# Altium schematic sheet Arduino.SchDoc
size A4
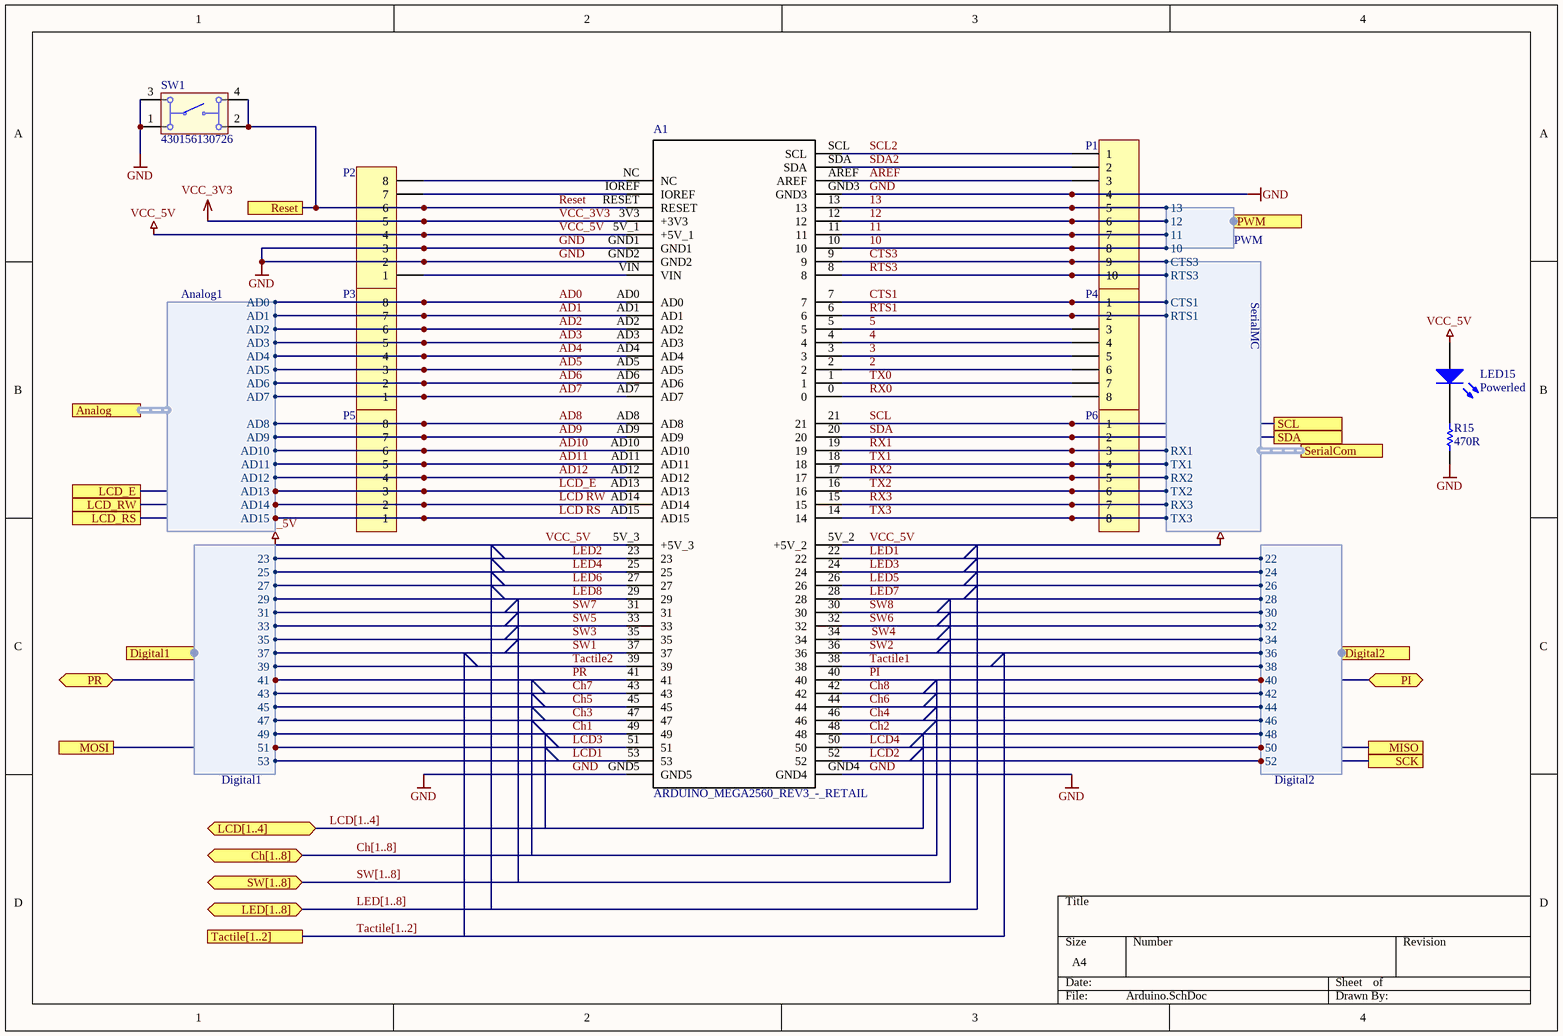
[diagram p0: Arduino.SchDoc]

## Parts
A1  ARDUINO_MEGA2560_REV3_-_RETAIL  [*ARDUINO_MEGA2560_REV3_-_RETAIL_ARDUINO_MEGA2560_REV3_-_RETAIL(Primary)]
LED15  Powerled  [1206_A]
P1  Header 10  [HDR1X10]  (value not drawn)
P2  Header 8  [HDR1X8]  (value not drawn)
P3  Header 8  [HDR1X8]  (value not drawn)
P4  Header 8  [HDR1X8]  (value not drawn)
P5  Header 8  [HDR1X8]  (value not drawn)
P6  Header 8  [HDR1X8]  (value not drawn)
R15  470R  [RESC0805(2012)_M]
SW1  430156130726  [430156130726]

## Ports
Analog (harness Analog1), Ch[1..8] (bidir), Digital1 (harness Digital1), Digital2 (harness Digital2), LCD[1..4] (bidir), LCD_E, LCD_RS, LCD_RW, LED[1..8] (bidir), MISO, MOSI, PI (bidir), PR (bidir), PWM (harness PWM), Reset, SCK, SCL, SDA, SerialCom (harness SerialMC), SW[1..8] (bidir), Tactile[1..2]

## Harnesses
SerialMC: TX3, RX3, TX2, RX2, TX1, CTS3, RTS3, CTS1, RTS1, RX1
Analog1: AD0, AD1, AD2, AD3, AD4, AD5, AD6, AD7, AD8, AD9, AD10, AD11, AD12, AD13, AD14, AD15
Digital1: 23, 25, 27, 29, 31, 33, 35, 37, 39, 41, 43, 45, 47, 49, 51, 53
Digital2: 22, 24, 26, 28, 30, 32, 34, 36, 38, 40, 42, 44, 46, 48, 50, 52
PWM: 10, 11, 12, 13

## Nets
GND: A1.GND1 A1.GND2 A1.GND3 A1.GND4 A1.GND5 P1.4 P2.2 P2.3 R15.1 SW1.1 SW1.3
VCC_3V3: A1.3V3(+3V3) P2.5
VCC_5V: A1.5V_1(+5V_1) A1.5V_2(+5V_2) A1.5V_3(+5V_3) LED15.2(A) P2.4
2: A1.2 P4.6
3: A1.3 P4.5
4: A1.4 P4.4
5: A1.5 P4.3
10: A1.10 P1.8 ; port PWM.10
11: A1.11 P1.7 ; port PWM.11
12: A1.12 P1.6 ; port PWM.12
13: A1.13 P1.5 ; port PWM.13
AD0: A1.AD0 P3.8 ; port Analog.AD0
AD1: A1.AD1 P3.7 ; port Analog.AD1
AD2: A1.AD2 P3.6 ; port Analog.AD2
AD3: A1.AD3 P3.5 ; port Analog.AD3
AD4: A1.AD4 P3.4 ; port Analog.AD4
AD5: A1.AD5 P3.3 ; port Analog.AD5
AD6: A1.AD6 P3.2 ; port Analog.AD6
AD7: A1.AD7 P3.1 ; port Analog.AD7
AD8: A1.AD8 P5.8 ; port Analog.AD8
AD9: A1.AD9 P5.7 ; port Analog.AD9
AD10: A1.AD10 P5.6 ; port Analog.AD10
AD11: A1.AD11 P5.5 ; port Analog.AD11
AD12: A1.AD12 P5.4 ; port Analog.AD12
AREF: A1.AREF P1.3
Ch1: A1.49 ; port Digital1.49
Ch2: A1.48 ; port Digital2.48
Ch3: A1.47 ; port Digital1.47
Ch4: A1.46 ; port Digital2.46
Ch5: A1.45 ; port Digital1.45
Ch6: A1.44 ; port Digital2.44
Ch7: A1.43 ; port Digital1.43
Ch8: A1.42 ; port Digital2.42
CTS1: A1.7 P4.1 ; port SerialCom.CTS1
CTS3: A1.9 P1.9 ; port SerialCom.CTS3
LCD1: A1.53 ; port Digital1.53
LCD2: A1.52 ; port SCK, port Digital2.52
LCD3: A1.51 ; port MOSI, port Digital1.51
LCD4: A1.50 ; port MISO, port Digital2.50
LCD RS: A1.AD15 P5.1 ; port LCD_RS, port Analog.AD15
LCD RW: A1.AD14 P5.2 ; port LCD_RW, port Analog.AD14
LCD_E: A1.AD13 P5.3 ; port LCD_E, port Analog.AD13
LED1: A1.22 ; port Digital2.22
LED2: A1.23 ; port Digital1.23
LED3: A1.24 ; port Digital2.24
LED4: A1.25 ; port Digital1.25
LED5: A1.26 ; port Digital2.26
LED6: A1.27 ; port Digital1.27
LED7: A1.28 ; port Digital2.28
LED8: A1.29 ; port Digital1.29
PI: A1.40 ; port PI, port Digital2.40
PR: A1.41 ; port PR, port Digital1.41
Reset: A1.RESET P2.6 SW1.2 SW1.4 ; port Reset
RTS1: A1.6 P4.2 ; port SerialCom.RTS1
RTS3: A1.8 P1.10 ; port SerialCom.RTS3
RX0: A1.0 P4.8
RX1: A1.19 P6.3 ; port SerialCom.RX1
RX2: A1.17 P6.5 ; port SerialCom.RX2
RX3: A1.15 P6.7 ; port SerialCom.RX3
SCL: A1.21 P6.1 ; port SCL
SCL2: A1.SCL P1.1
SDA: A1.20 P6.2 ; port SDA
SDA2: A1.SDA P1.2
SW1: A1.37 ; port Digital1.37
SW2: A1.36 ; port Digital2.36
SW3: A1.35 ; port Digital1.35
SW4: A1.34 ; port Digital2.34
SW5: A1.33 ; port Digital1.33
SW6: A1.32 ; port Digital2.32
SW7: A1.31 ; port Digital1.31
SW8: A1.30 ; port Digital2.30
Tactile1: A1.38 ; port Digital2.38
Tactile2: A1.39 ; port Digital1.39
TX0: A1.1 P4.7
TX1: A1.18 P6.4 ; port SerialCom.TX1
TX2: A1.16 P6.6 ; port SerialCom.TX2
TX3: A1.14 P6.8 ; port SerialCom.TX3
NetA1_IOREF: A1.IOREF P2.7
NetA1_NC: A1.NC P2.8
NetA1_VIN: A1.VIN P2.1
NetLED15_1: LED15.1(K) R15.2

## Buses and harness runs
bus Ch[1..8] = port Ch[1..8]
bus LCD[1..4] = port LCD[1..4]
bus LED[1..8] =  = port LED[1..8]
bus SW[1..8] = port SW[1..8]
bus Tactile[1..2] = port Tactile[1..2]

## Library data of the parts
A1 = ARDUINO_MEGA2560_REV3_-_RETAIL: Dev.kit: Arduino; SPI, TWI, UART; ICSP, USB B, pin strips, supply; MP: ARDUINO MEGA2560 REV3 - RETAIL; Price: None; MF: Arduino; Package: None; Availability: Unavailable; SnapEDA_Link: https://www.snapeda.com/parts/ARDUINO%20MEGA2560%20REV3%20-%20RETAIL/Arduino/view-part/?ref=snap; Value: *
LED15 = CMP-1426-00013-1: SMD mono-color Chip LED, WL-SMCW, Red; PartNumber: 150120RS75000; Manufacturer: Wuerth Elektronik; Color: Red; ComponentLink2URL: http://katalog.we-online.com/led/datasheet/150120RS75000.pdf; ComponentLink2Description: Datasheet; ComponentLink1Description: Manufacturer URL; ComponentLink1URL: http://www.we-online.com; PackageReference: 1206_A
P1 = Header 10: Header, 10-Pin; LatestRevisionDate: 17-Jul-2002; LatestRevisionNote: Re-released for DXP Platform.; Publisher: Altium Limited
P2-P6 = Header 8: Header, 8-Pin; LatestRevisionDate: 17-Jul-2002; LatestRevisionNote: Re-released for DXP Platform.; Publisher: Altium Limited
R15 = CMP-1013-00473-1: 470R 0.125W 1% 0805 (2012 Metric)  SMD; Case-Metric: 2012; Value: 470.00 Ohm; Case-EIA: 0805; Power: 0.125 W; Technology: SMT; Tolerance: 1 %
SW1 = CMP-1453-00009-1: WS-TATV THT Tact Switch 6X6 mm; Manufacturer: Wuerth Elektronik; NoPins: 04; PartNumber: 430156130726; ComponentLink1Description: Manufacturer URL; ComponentLink1URL: http://www.we-online.com; ComponentLink2Description: Datasheet; ComponentLink2URL: http://katalog.we-online.de/em/datasheet/4301x6.pdf; PackageReference: 430156130726